# EAGLE schematic Addr (EAGLE 7.6.0)
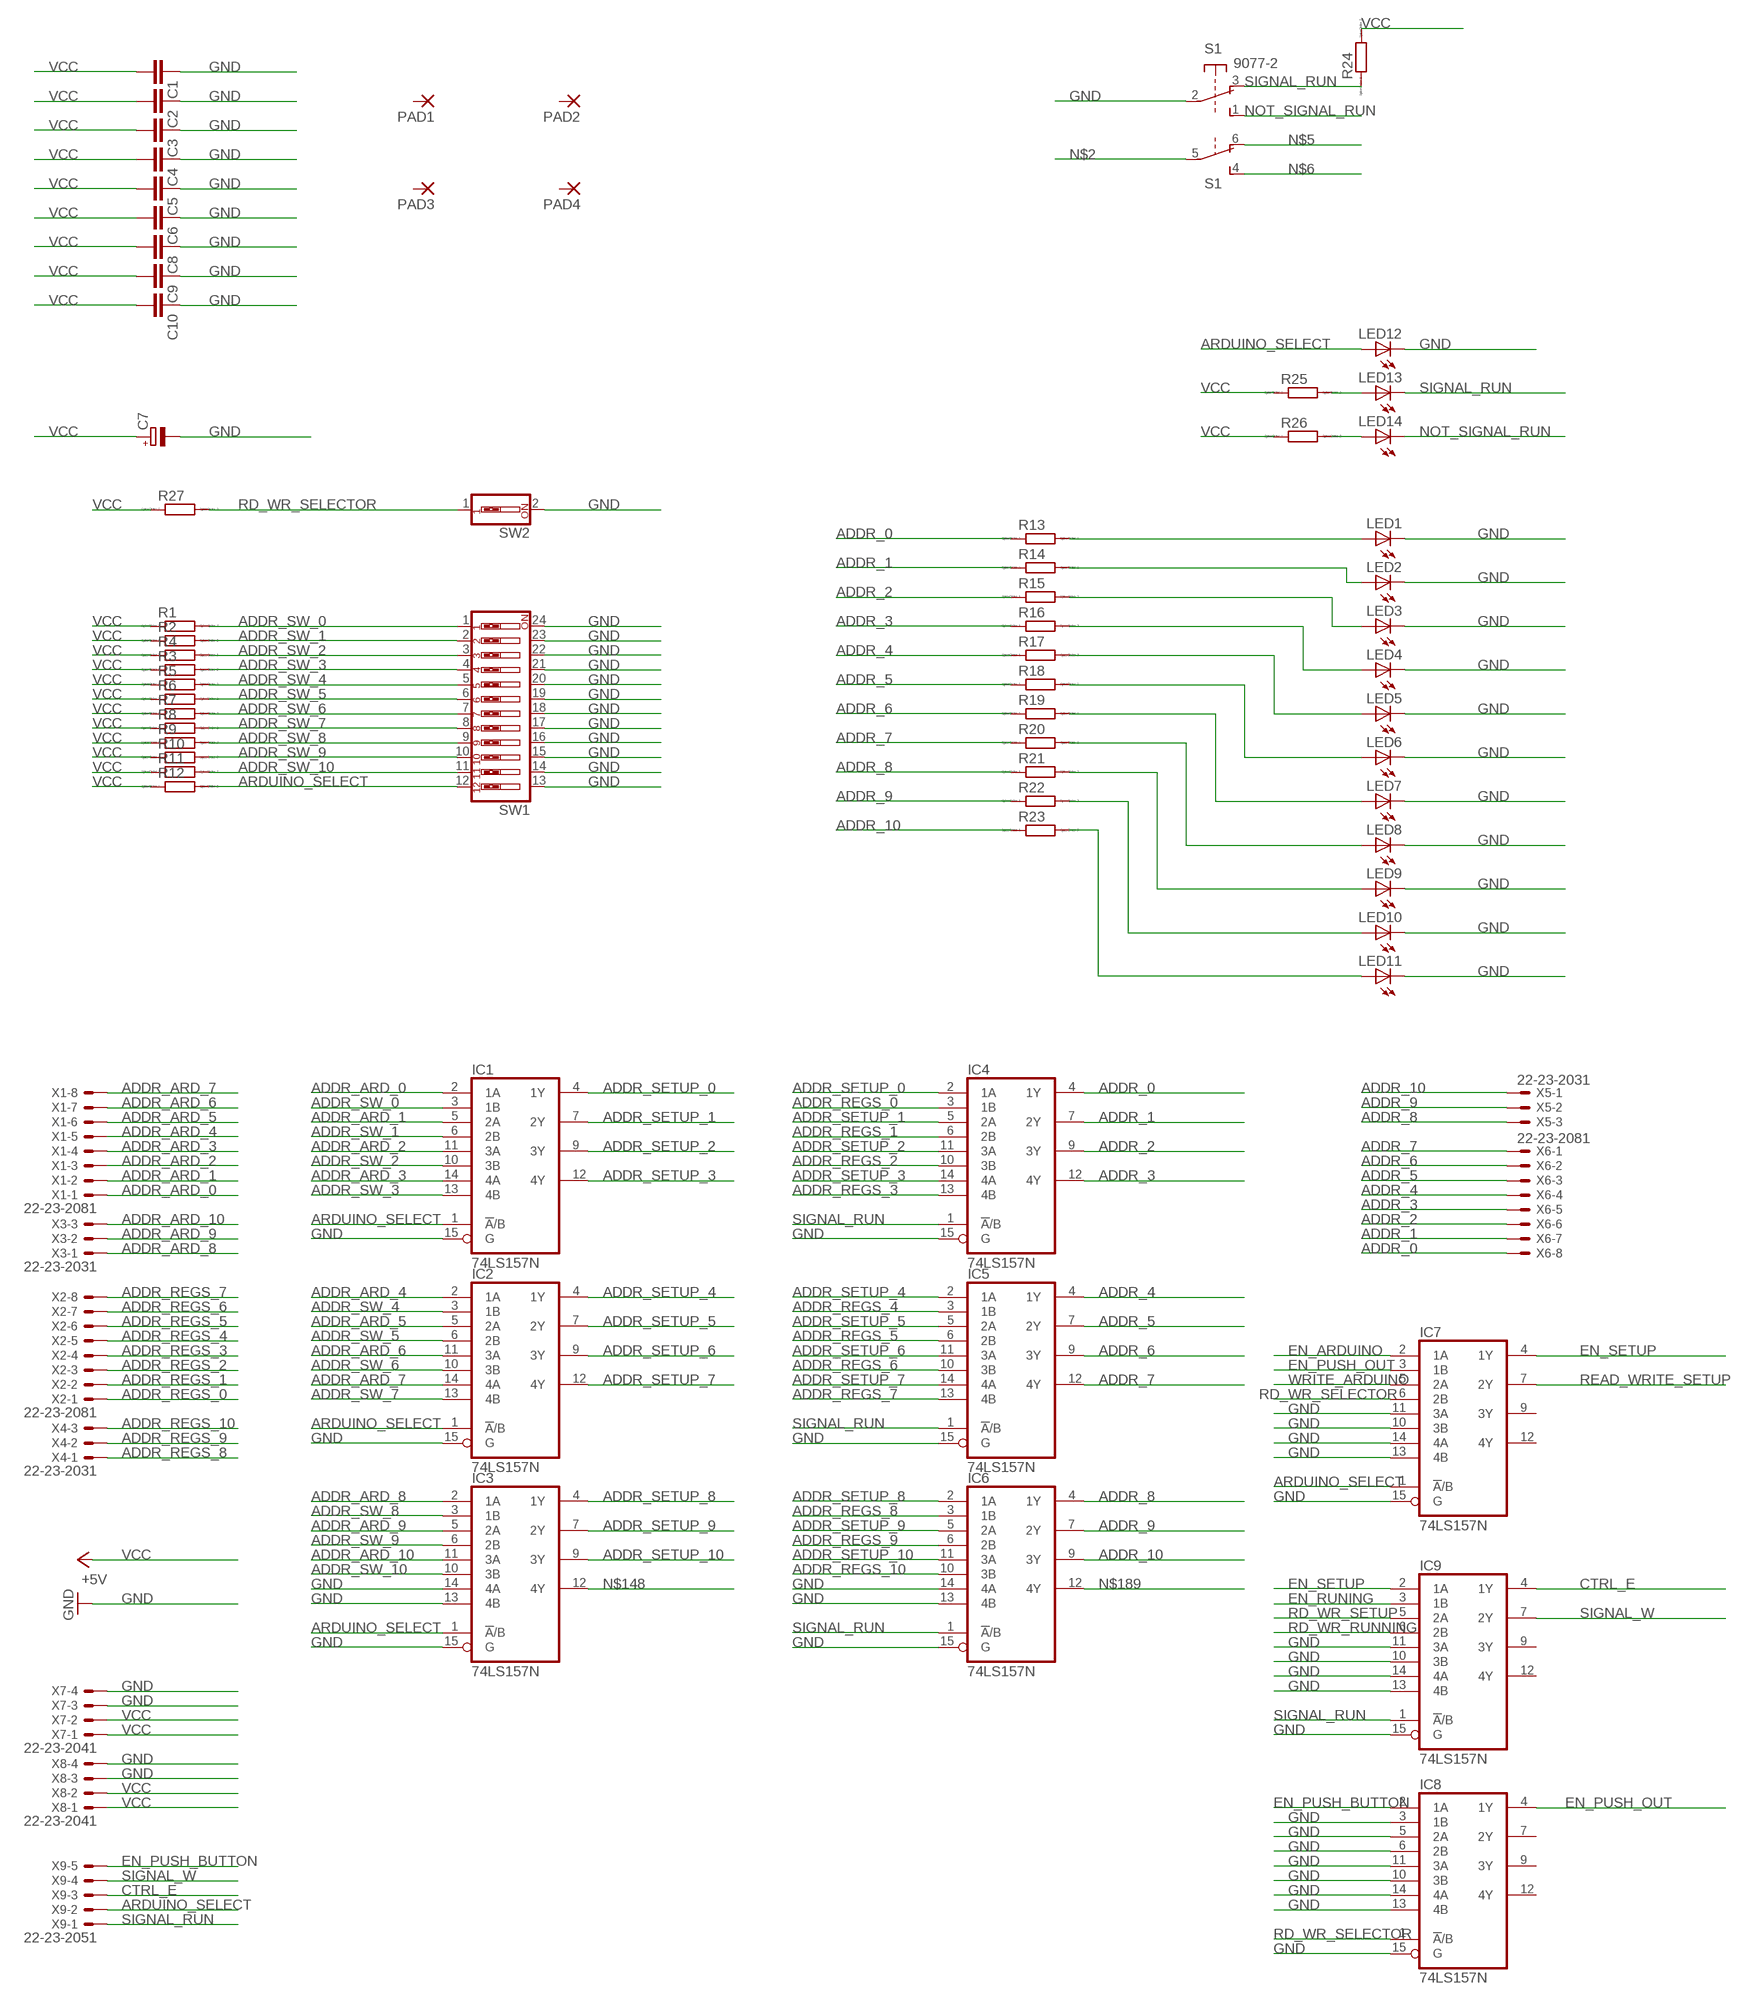
[diagram p0: schematic, sheet 1]

## Parts
C1  C-EU025-025X050  [C025-025X050]
C2  C-EU025-025X050  [C025-025X050]
C3  C-EU025-025X050  [C025-025X050]
C4  C-EU025-025X050  [C025-025X050]
C5  C-EU025-025X050  [C025-025X050]
C6  C-EU025-025X050  [C025-025X050]
C7  CPOL-EUE2.5-6  [E2,5-6]
C8  C-EU025-025X050  [C025-025X050]
C9  C-EU025-025X050  [C025-025X050]
C10  C-EU025-025X050  [C025-025X050]
IC1  74LS157N  [DIL16]
IC2  74LS157N  [DIL16]
IC3  74LS157N  [DIL16]
IC4  74LS157N  [DIL16]
IC5  74LS157N  [DIL16]
IC6  74LS157N  [DIL16]
IC7  74LS157N  [DIL16]
IC8  74LS157N  [DIL16]
IC9  74LS157N  [DIL16]
LED1  LED5MM  [LED5MM]
LED2  LED5MM  [LED5MM]
LED3  LED5MM  [LED5MM]
LED4  LED5MM  [LED5MM]
LED5  LED5MM  [LED5MM]
LED6  LED5MM  [LED5MM]
LED7  LED5MM  [LED5MM]
LED8  LED5MM  [LED5MM]
LED9  LED5MM  [LED5MM]
LED10  LED5MM  [LED5MM]
LED11  LED5MM  [LED5MM]
LED12  LED5MM  [LED5MM]
LED13  LED5MM  [LED5MM]
LED14  LED5MM  [LED5MM]
PAD1  3,17/1,3  [3,17/1,3]
PAD2  3,17/1,3  [3,17/1,3]
PAD3  3,17/1,3  [3,17/1,3]
PAD4  3,17/1,3  [3,17/1,3]
R1  R0207/10  [0207/10]
R2  R0207/10  [0207/10]
R3  R0207/10  [0207/10]
R4  R0207/10  [0207/10]
R5  R0207/10  [0207/10]
R6  R0207/10  [0207/10]
R7  R0207/10  [0207/10]
R8  R0207/10  [0207/10]
R9  R0207/10  [0207/10]
R10  R0207/10  [0207/10]
R11  R0207/10  [0207/10]
R12  R0207/10  [0207/10]
R13  R0207/10  [0207/10]
R14  R0207/10  [0207/10]
R15  R0207/10  [0207/10]
R16  R0207/10  [0207/10]
R17  R0207/10  [0207/10]
R18  R0207/10  [0207/10]
R19  R0207/10  [0207/10]
R20  R0207/10  [0207/10]
R21  R0207/10  [0207/10]
R22  R0207/10  [0207/10]
R23  R0207/10  [0207/10]
R24  R0207/10  [0207/10]
R25  R0207/10  [0207/10]
R26  R0207/10  [0207/10]
R27  R0207/10  [0207/10]
S1  9077-2  [9077-2]
SW1  SW_DIP-12  [EDG-12]
SW2  SW_DIP-1  [EDG-01]
X1  22-23-2081  [22-23-2081]
X2  22-23-2081  [22-23-2081]
X3  22-23-2031  [22-23-2031]
X4  22-23-2031  [22-23-2031]
X5  22-23-2031  [22-23-2031]
X6  22-23-2081  [22-23-2081]
X7  22-23-2041  [22-23-2041]
X8  22-23-2041  [22-23-2041]
X9  22-23-2051  [22-23-2051]

## Nets
ADDR_0: IC4.4(1Y) R13.1 X6.8
ADDR_1: IC4.7(2Y) R14.1 X6.7
ADDR_2: IC4.9(3Y) R15.1 X6.6
ADDR_3: IC4.12(4Y) R16.1 X6.5
ADDR_4: IC5.4(1Y) R17.1 X6.4
ADDR_5: IC5.7(2Y) R18.1 X6.3
ADDR_6: IC5.9(3Y) R19.1 X6.2
ADDR_7: IC5.12(4Y) R20.1 X6.1
ADDR_8: IC6.4(1Y) R21.1 X5.3
ADDR_9: IC6.7(2Y) R22.1 X5.2
ADDR_10: IC6.9(3Y) R23.1 X5.1
ADDR_ARD_0: IC1.2(1A) X1.1
ADDR_ARD_1: IC1.5(2A) X1.2
ADDR_ARD_2: IC1.11(3A) X1.3
ADDR_ARD_3: IC1.14(4A) X1.4
ADDR_ARD_4: IC2.2(1A) X1.5
ADDR_ARD_5: IC2.5(2A) X1.6
ADDR_ARD_6: IC2.11(3A) X1.7
ADDR_ARD_7: IC2.14(4A) X1.8
ADDR_ARD_8: IC3.2(1A) X3.1
ADDR_ARD_9: IC3.5(2A) X3.2
ADDR_ARD_10: IC3.11(3A) X3.3
ADDR_REGS_0: IC4.3(1B) X2.1
ADDR_REGS_1: IC4.6(2B) X2.2
ADDR_REGS_2: IC4.10(3B) X2.3
ADDR_REGS_3: IC4.13(4B) X2.4
ADDR_REGS_4: IC5.3(1B) X2.5
ADDR_REGS_5: IC5.6(2B) X2.6
ADDR_REGS_6: IC5.10(3B) X2.7
ADDR_REGS_7: IC5.13(4B) X2.8
ADDR_REGS_8: IC6.3(1B) X4.1
ADDR_REGS_9: IC6.6(2B) X4.2
ADDR_REGS_10: IC6.10(3B) X4.3
ADDR_SETUP_0: IC1.4(1Y) IC4.2(1A)
ADDR_SETUP_1: IC1.7(2Y) IC4.5(2A)
ADDR_SETUP_2: IC1.9(3Y) IC4.11(3A)
ADDR_SETUP_3: IC1.12(4Y) IC4.14(4A)
ADDR_SETUP_4: IC2.4(1Y) IC5.2(1A)
ADDR_SETUP_5: IC2.7(2Y) IC5.5(2A)
ADDR_SETUP_6: IC2.9(3Y) IC5.11(3A)
ADDR_SETUP_7: IC2.12(4Y) IC5.14(4A)
ADDR_SETUP_8: IC3.4(1Y) IC6.2(1A)
ADDR_SETUP_9: IC3.7(2Y) IC6.5(2A)
ADDR_SETUP_10: IC3.9(3Y) IC6.11(3A)
ADDR_SW_0: IC1.3(1B) R1.2 SW1.1
ADDR_SW_1: IC1.6(2B) R2.2 SW1.2
ADDR_SW_2: IC1.10(3B) R4.2 SW1.3
ADDR_SW_3: IC1.13(4B) R3.2 SW1.4
ADDR_SW_4: IC2.3(1B) R5.2 SW1.5
ADDR_SW_5: IC2.6(2B) R6.2 SW1.6
ADDR_SW_6: IC2.10(3B) R7.2 SW1.7
ADDR_SW_7: IC2.13(4B) R8.2 SW1.8
ADDR_SW_8: IC3.3(1B) R9.2 SW1.9
ADDR_SW_9: IC3.6(2B) R10.2 SW1.10
ADDR_SW_10: IC3.10(3B) R11.2 SW1.11
ARDUINO_SELECT: IC1.1(!A!/B) IC2.1(!A!/B) IC3.1(!A!/B) IC7.1(!A!/B) LED12.A R12.2 SW1.12 X9.2
CTRL_E: IC9.4(1Y) X9.3
EN_ARDUINO: IC7.2(1A)
EN_PUSH_BUTTON: IC8.2(1A) X9.5
EN_PUSH_OUT: IC7.3(1B) IC8.4(1Y)
EN_RUNING: IC9.3(1B)
EN_SETUP: IC7.4(1Y) IC9.2(1A)
GND [suply]: C1.1 C2.1 C3.1 C4.1 C5.1 C6.1 C7.- C8.1 C9.1 C10.1 IC1.15(G) IC2.15(G) IC3.13(4B) IC3.14(4A) IC3.15(G) IC4.15(G) IC5.15(G) IC6.13(4B) IC6.14(4A) IC6.15(G) IC7.10(3B) IC7.11(3A) IC7.13(4B) IC7.14(4A) IC7.15(G) IC8.3(1B) IC8.5(2A) IC8.6(2B) IC8.10(3B) IC8.11(3A) IC8.13(4B) IC8.14(4A) IC8.15(G) IC9.10(3B) IC9.11(3A) IC9.13(4B) IC9.14(4A) IC9.15(G) LED1.K(C) LED2.K(C) LED3.K(C) LED4.K(C) LED5.K(C) LED6.K(C) LED7.K(C) LED8.K(C) LED9.K(C) LED10.K(C) LED11.K(C) LED12.K(C) S1.2(1:P) SW1.13 SW1.14 SW1.15 SW1.16 SW1.17 SW1.18 SW1.19 SW1.20 SW1.21 SW1.22 SW1.23 SW1.24 SW2.2 X7.3 X7.4 X8.3 X8.4
N$2: S1.5(2:P)
N$4: LED13.A R25.2
N$5: S1.6(2:O)
N$6: S1.4(2:S)
N$7: LED14.A R26.2
N$48: LED1.A R13.2
N$49: LED2.A R14.2
N$50: LED3.A R15.2
N$51: LED4.A R16.2
N$52: LED5.A R17.2
N$53: LED6.A R18.2
N$54: LED7.A R19.2
N$55: LED8.A R20.2
N$56: LED9.A R21.2
N$57: LED10.A R22.2
N$58: LED11.A R23.2
N$148: IC3.12(4Y)
N$189: IC6.12(4Y)
NOT_SIGNAL_RUN: LED14.K(C) S1.1(1:S)
RD_WR_RUNNING: IC9.6(2B)
RD_WR_SELECTOR: IC7.6(2B) IC8.1(!A!/B) R27.2 SW2.1
RD_WR_SETUP: IC9.5(2A)
READ_WRITE_SETUP: IC7.7(2Y)
SIGNAL_RUN: IC4.1(!A!/B) IC5.1(!A!/B) IC6.1(!A!/B) IC9.1(!A!/B) LED13.K(C) R24.1 S1.3(1:O) X9.1
SIGNAL_W: IC9.7(2Y) X9.4
VCC [suply]: C1.2 C2.2 C3.2 C4.2 C5.2 C6.2 C7.+ C8.2 C9.2 C10.2 R1.1 R2.1 R3.1 R4.1 R5.1 R6.1 R7.1 R8.1 R9.1 R10.1 R11.1 R12.1 R24.2 R25.1 R26.1 R27.1 X7.1 X7.2 X8.1 X8.2 ; supply symbol labelled +5V
WRITE_ARDUINO: IC7.5(2A)
Unconnected: IC7.9(3Y) IC7.12(4Y) IC8.7(2Y) IC8.9(3Y) IC8.12(4Y) IC9.9(3Y) IC9.12(4Y) PAD1.1(P) PAD2.1(P) PAD3.1(P) PAD4.1(P)

## Power pins joined to a net without a drawn wire
GND: IC1.8(GND) IC2.8(GND) IC3.8(GND) IC4.8(GND) IC5.8(GND) IC6.8(GND) IC7.8(GND) IC8.8(GND) IC9.8(GND)
VCC: IC1.16(VCC) IC2.16(VCC) IC3.16(VCC) IC4.16(VCC) IC5.16(VCC) IC6.16(VCC) IC7.16(VCC) IC8.16(VCC) IC9.16(VCC)

## Library data of the parts
C1-C6 C8-C10 = rcl:C-EU: CAPACITOR, European symbol
C7 = rcl:CPOL-EU: POLARIZED CAPACITOR, European symbol
IC1-IC9 = 74xx-us:74*157: Quadruple 2-line to 1-line data SELECTOR/MULTIPLEXER
LED1-LED14 = led:LED: LED OSRAM: - CHIPLED LG R971, LG N971, LY N971, LG Q971, LY Q971, LO R971, LY R971 LH N974, LH R974 LS Q976, LO Q976, LY Q976 LO Q996 - Hyper CHIPLED LW Q18S LB Q993, LB Q99A, LB R99A - SideLED LS A670, LO A670, LY A670, LG A670, LP A670 LB A673, LV A673, LT A673, LW A673 LH A674 LY A675 LS A676, LA A676, LO A676, LY A676, LW A676 LS A679, LY A679, LG A679 - Hyper Micro SIDELED® LS Y876, LA Y876, LO Y876, LY Y876 LT Y87S - SmartLED LW L88C, LW L88S LB L89C, LB L89S, LG L890 LS L89K, LO L89K, LY L89K LS L896, LA L896, LO L896, LY L896 - TOPLED LS T670, LO T670, LY T670, LG T670, LP T670 LSG T670, LSP T670, LSY T670, LOP T670, LYG T670 LG T671, LOG T671, LSG T671 LB T673, LV T673, LT T673, LW T673 LH T674 LS T676, LA T676, LO T676, LY T676, LB T676, LH T676, LSB T676, LW T676 LB T67C, LV T67C, LT T67C, LS T67K, LO T67K, LY T67K, LW E67C LS E67B, LA E67B, LO E67B, LY E67B, LB E67C, LV E67C, LT E67C LW T67C LS T679, LY T679, LG T679 LS T770, LO T770, LY T770, LG T770, LP T770 LB T773, LV T773, LT T773, LW T773 LH T774 LS E675, LA E675, LY E675, LS T675 LS T776, LA T776, LO T776, LY T776, LB T776 LHGB T686 LT T68C, LB T68C - Hyper Mini TOPLED® LB M676 - Mini TOPLED Santana® LG M470 LS M47K, LO M47K, LY M47K Source: http://www.osram.convergy.de LUXEON: - LUMILED® LXK2-PW12-R00, LXK2-PW12-S00, LXK2-PW14-U00, LXK2-PW14-V00 LXK2-PM12-R00, LXK2-PM12-S00, LXK2-PM14-U00 LXK2-PE12-Q00, LXK2-PE12-R00, LXK2-PE12-S00, LXK2-PE14-T00, LXK2-PE14-U00 LXK2-PB12-K00, LXK2-PB12-L00, LXK2-PB12-M00, LXK2-PB14-N00, LXK2-PB14-P00, LXK2-PB14-Q00 LXK2-PR12-L00, LXK2-PR12-M00, LXK2-PR14-Q00, LXK2-PR14-R00 LXK2-PD12-Q00, LXK2-PD12-R00, LXK2-PD12-S00 LXK2-PH12-R00, LXK2-PH12-S00 LXK2-PL12-P00, LXK2-PL12-Q00, LXK2-PL12-R00 Source: www.luxeon.com KINGBRIGHT: KA-3528ASYC Source: www.kingbright.com
PAD1-PAD4 = wirepad:3,17/1,3: THROUGH-HOLE PAD
R1-R27 = eagle-ltspice:R: RESISTOR, European symbol; SPICEMODEL: NONE; SPICEPREFIX: R
S1 = switch-misc:9077-2: MARQUARDT SWITCH 9077.0200 Distributor: Buerklin <https://www.buerklin.com/default.asp?event=ShowArtikel%2812G2822%29&l=d&jump=ArtNr_12G2822>
SW1 = special:SW_DIP-12: DIP SWITCH
SW2 = special:SW_DIP-1: DIP SWITCH
X1 X2 X6 = con-molex:22-23-2081: .100" (2.54mm) Center Header - 8 Pin; MF: MOLEX; MPN: 22-23-2081; OC_FARNELL: 1756826; OC_NEWARK: 01C7592
X3-X5 = con-molex:22-23-2031: .100" (2.54mm) Center Header - 3 Pin; MF: MOLEX; MPN: 22-23-2031; OC_FARNELL: 1462950; OC_NEWARK: 30C0862
X7 X8 = con-molex:22-23-2041: .100" (2.54mm) Center Header - 4 Pin; MF: MOLEX; MPN: 22-23-2041; OC_FARNELL: 1462920; OC_NEWARK: 38C0355
X9 = con-molex:22-23-2051: .100" (2.54mm) Center Header - 5 Pin; MF: MOLEX; MPN: 22-23-2051; OC_FARNELL: 1462952; OC_NEWARK: 38C9178

## Net classes
1 suply: width 1.016 mm